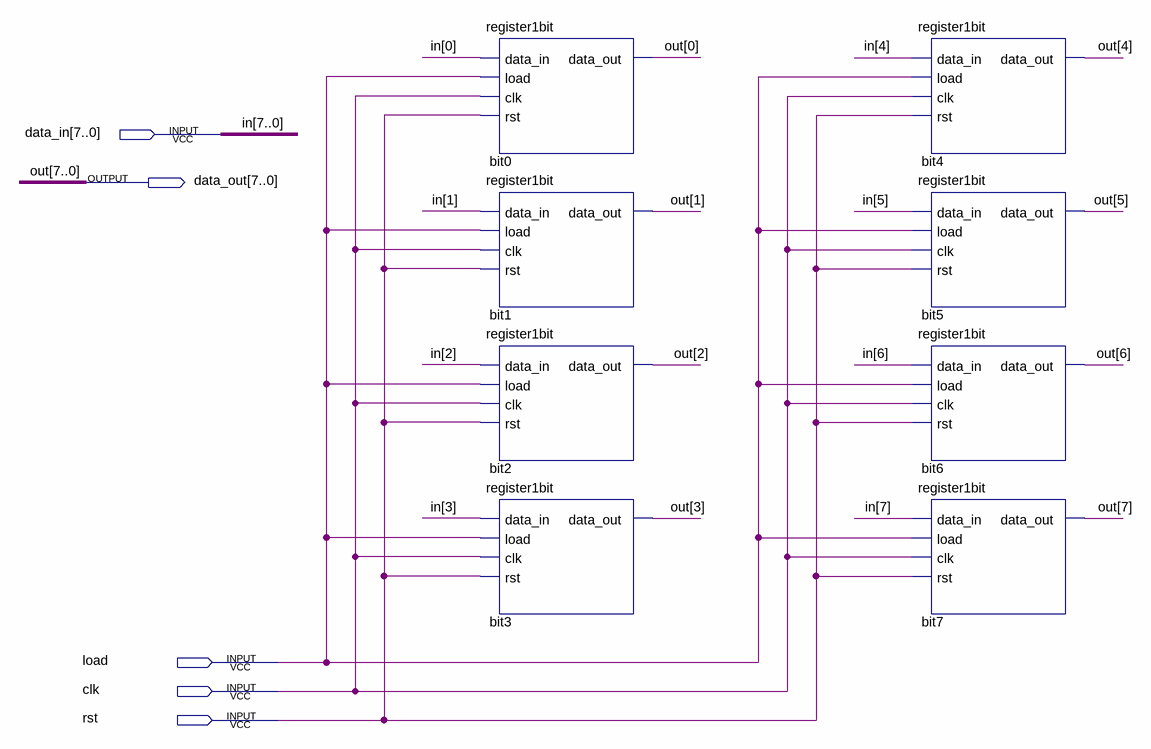
[diagram p0: schematic sheet]
// Quartus schematic register8bit.bdf as structural Verilog: 8 symbols, 5 pins
module register8bit (
  input  [7:0] data_in,
  input  load,
  input  clk,
  input  rst,
  output [7:0] data_out
);

  register1bit bit0 (.data_in(data_in[0]), .load(load), .clk(clk), .rst(rst), .data_out(data_out[0]));
  register1bit bit1 (.data_in(data_in[1]), .load(load), .clk(clk), .rst(rst), .data_out(data_out[1]));
  register1bit bit2 (.data_in(data_in[2]), .load(load), .clk(clk), .rst(rst), .data_out(data_out[2]));
  register1bit bit3 (.data_in(data_in[3]), .load(load), .clk(clk), .rst(rst), .data_out(data_out[3]));
  register1bit bit4 (.data_in(data_in[4]), .load(load), .clk(clk), .rst(rst), .data_out(data_out[4]));
  register1bit bit5 (.data_in(data_in[5]), .load(load), .clk(clk), .rst(rst), .data_out(data_out[5]));
  register1bit bit6 (.data_in(data_in[6]), .load(load), .clk(clk), .rst(rst), .data_out(data_out[6]));
  register1bit bit7 (.data_in(data_in[7]), .load(load), .clk(clk), .rst(rst), .data_out(data_out[7]));

  // Other names for the same wires on the sheet: in[7:0] = data_in; out[7:0] = data_out
endmodule
